# EAGLE design SparkFun_RS323_Shifter (EAGLE 7.2.0)
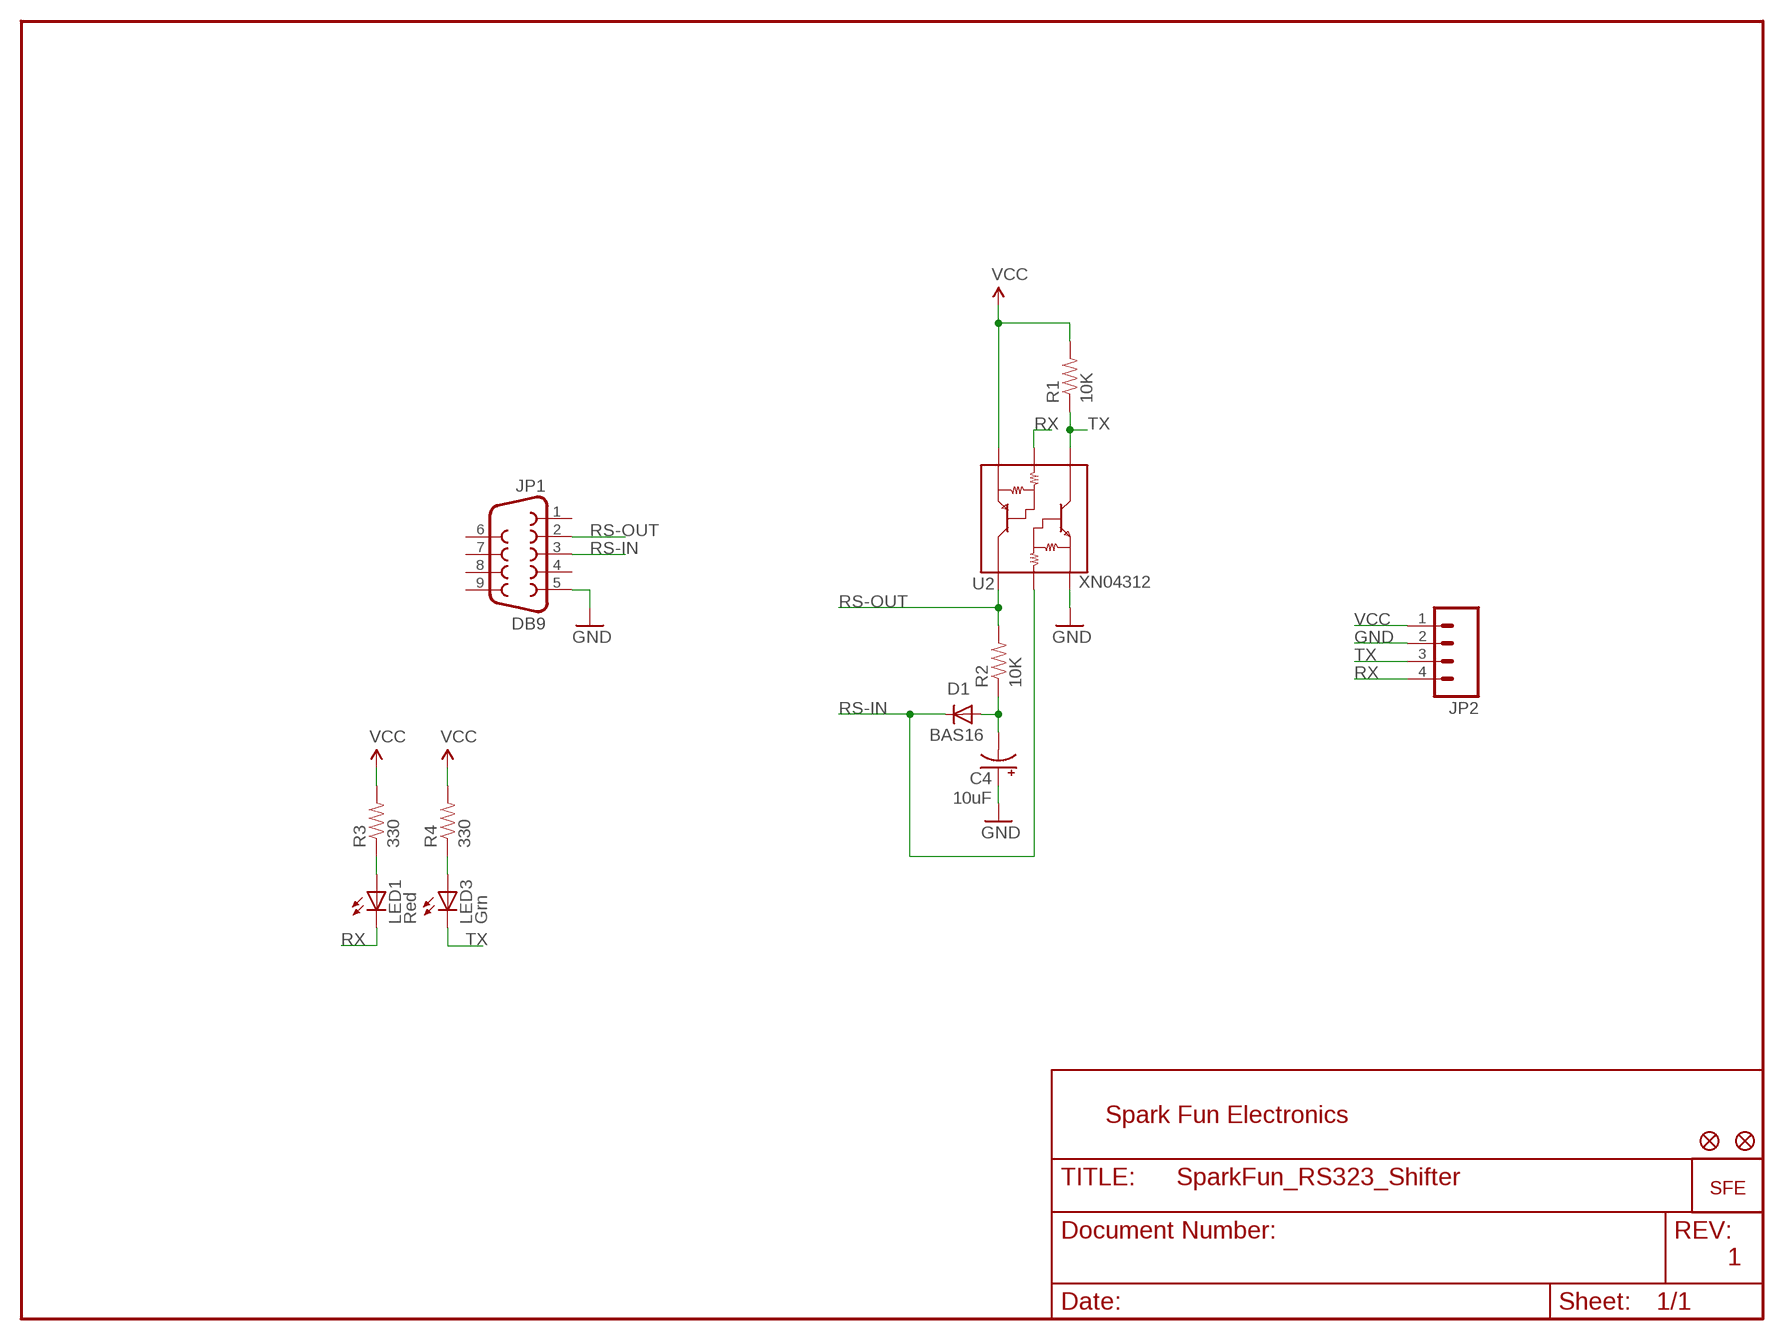
[diagram p0: schematic, sheet 1]

## Parts
C4  10uF  CAP_POL1206  [EIA3216]
D1  BAS16  DIODESOD  [SOD-323]
E$1  FIDUCIAL1X2  [FIDUCIAL-1X2]
E$2  FIDUCIAL1X2  [FIDUCIAL-1X2]
JP1  DB9  DB9FEMALE  [DB9]
JP2  M04PTH  [1X04]
LED1  Red  LED1206  [LED-1206]
LED3  Grn  LED1206  [LED-1206]
R1  10K  RESISTOR0603-RES  [0603-RES]
R2  10K  RESISTOR0603-RES  [0603-RES]
R3  330  RESISTOR0603-RES  [0603-RES]
R4  330  RESISTOR0603-RES  [0603-RES]
U2  XN04312  XN04312SOT  [SOT23-6]
U$1  LOGO-SFENEW  [SFE-NEW-WEBLOGO]

## Nets
GND: C4.A(+) JP1.5 JP2.2 U2.6(E1)
N$1: LED1.A R3.1
N$2: LED3.A R4.1
N$4: C4.C(-) D1.2(A) R2.1
RS-IN: D1.1(C) JP1.3 U2.5(B1)
RS-OUT: JP1.2 R2.2 U2.4(C2)
RX: JP2.4 LED1.C U2.2(B2)
TX: JP2.3 LED3.C R1.1 U2.1(C1)
VCC: JP2.1 R1.2 R3.2 R4.2 U2.3(E2)
Unconnected: JP1.1 JP1.4 JP1.6 JP1.7 JP1.8 JP1.9

## Notes on the sheet
- Spark Fun Electronics
- 1

## Library data of the parts
C4 = SparkFun:CAP_POL: Capacitor Polarized These are standard SMD and PTH capacitors. Normally 10uF, 47uF, and 100uF in electrolytic and tantalum varieties. Always verify the external diameter of the through hole cap, it varies with capacity, voltage, and manufacturer. The EIA devices should be standard.
D1 = SparkFun:DIODE: Diode These are standard reverse protection diodes and small signal diodes. SMA package can handle up to about 1A. SOD-323 can handle about 200mA. What the SOD-323 package when ordering, there are some mfgs out there that are 5-pin packages.
E$1 E$2 = SparkFun:FIDUCIAL: Fiducial Alignment Points Various fiducial points for machine vision alignment.
JP1 = SparkFun:DB9: DB9 Connector Standard DB9 (D-Sub 9) serial connector. Can be used for CAN bus as well as RS485 and RS232. Footprint production proven. Spark Fun Electronics SKU : PRT-00429
JP2 = SparkFun:M04: Header 4 Standard 4-pin 0.1" header. Use with straight break away headers (SKU : PRT-00116), right angle break away headers (PRT-00553), swiss pins (PRT-00743), machine pins (PRT-00117), and female headers (PRT-00115). Molex polarized connector foot print use with SKU : PRT-08231 with associated crimp pins and housings.
LED1 LED3 = SparkFun:LED: LEDs Standard schematic elements and footprints for 5mm, 3mm, 1206, and 0603 sized LEDs. 5mm - Spark Fun Electronics SKU : COM-00529 (and others)
R1-R4 = SparkFun:RESISTOR: Resistor Basic schematic elements and footprints for 0603, 1206, and PTH resistors.
U2 = SparkFun:XN04312: NPN/PNP Transistor Array Handy dandy transistor array for level shifting and inverting signals. Spark Fun Electronics SKU : COM-00588
U$1 = SparkFun:LOGO-SFE: Spark Fun Electronics PCB Logo This is the standard Spark Fun Electronics PCB logo.

## Net classes
0 default: width 0.203 mm
1 power: width 0.203 mm

## Board
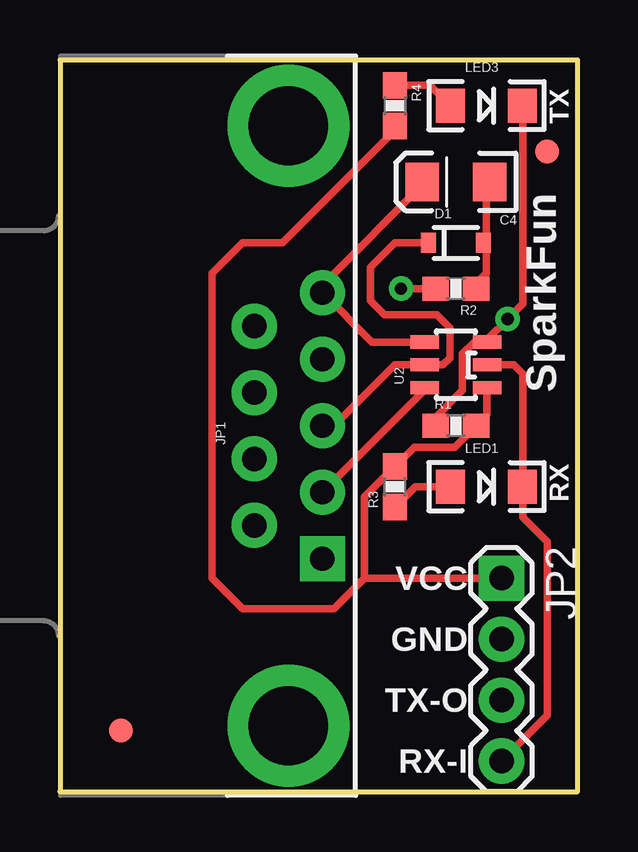
[diagram p1: board, top side]
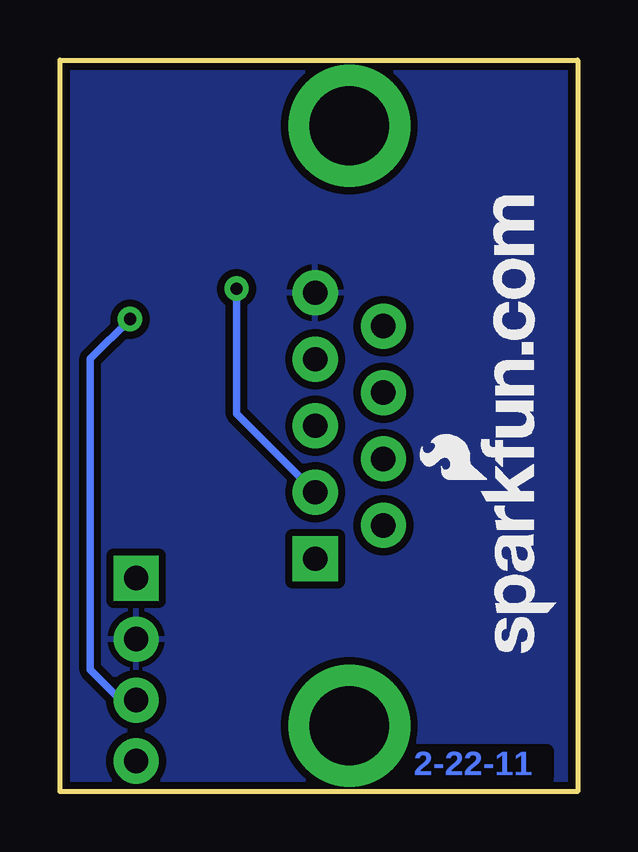
[diagram p2: board, bottom side, seen from below]

Size 21.59 x 30.48 mm. Coordinates in mm from the lower left corner, seen from the top.
Outline: 0,0 21.59,0 21.59,30.48 0,30.48 0,0
Copper layers (1*16): Top 0.035mm / dielectric 1.5mm / Bottom 0.035mm
Design rules "SparkFun": minimum track width 8mil, minimum drill 20mil, track to track 8mil, track to pad 8mil, pad to pad 8mil, via to via 8mil, smd to smd 8mil, copper to edge 10mil, drill to drill 8mil, minimum pad ring 12mil, minimum via ring 10mil, stop-mask expansion 4mil, vias tented up to drill 20mil, thermal gap 10mil

### Footprints (pad centres in the part's own frame; a part is rotated, then mirrored left to right if it is on the bottom)
EIA3216 = smd 1.4 x 1.6: A 1.4,0; C -1.4,0
SOD-323 = smd 0.63 x 0.83: 1 -1.15,0; 2 1.15,0
FIDUCIAL-1X2 = smd 1 x 1: 1 0,0
DB9 = drill 1.016 pad 1.88 square: 1 -5.54,-1.42 | drill 1.016 pad 1.88: 2 -2.77,-1.42; 3 0,-1.42; 4 2.77,-1.42; 5 5.54,-1.42; 6 -4.15,1.42; 7 -1.38,1.42; 8 1.38,1.42; 9 4.15,1.42 | drill 3.302 pad 5.08: G1 -12.5,0; G2 12.5,0
1X04 = drill 1.016 pad 1.88 square: 1 0,0 | drill 1.016 pad 1.88: 2 2.54,0; 3 5.08,0; 4 7.62,0
LED-1206 = smd 1.2 x 1.4: A -1.5,0; C 1.5,0
0603-RES = smd 1.1 x 1: 1 -0.85,0; 2 0.85,0
SOT23-6 = smd 0.55 x 1.2: 1 0.95,-1.3; 2 0,-1.3; 3 -0.95,-1.3; 4 -0.95,1.3; 5 0,1.3; 6 0.95,1.3

### Placement (x,y rotation side)
C4  16.51,25.4 180 top
D1  16.51,22.86 0 top
E$1  2.54,2.54 0 top
E$2  20.32,26.67 0 top
JP1  9.53,15.24 90 top
JP2  18.41,8.89 270 top
LED1  17.78,12.7 0 top
LED3  17.78,28.57 0 top
R1  16.51,15.24 0 top
R2  16.51,20.95 180 top
R3  13.97,12.7 90 top
R4  13.97,28.57 270 top
U2  16.51,17.78 90 top
U$1  0.9,5.79 90 bottom

### Tracks (layer width: path | path; a pad name or v marks a point on that pad's centre or on a via)
GND
  Top 0.305: C4.A 15.24,25.4 10.95,21.11 JP1.5 10.95,20.8 | 10.95,20.8 10.92,20.83 | U2.6 13.02,18.73 10.95,20.8
  Bottom 0.305: 10.79,20.95 10.84,20.91 JP1.5
  pour Bottom (isolate 0.305): 0,30.48 21.59,30.48 21.59,0 0,0
N$1
  Top 0.305: 16.51,12.7 LED1.A 14.82,12.7 R3.1
N$2
  Top 0.305: 16.26,28.57 LED3.A 15.43,29.43 R4.1
N$4
  Top 0.305: C4.C 17.78,25.4 17.78,22.98 D1.2 17.78,22.86 17.78,21.59 17.16,20.97 R2.1
RS-IN
  Top 0.305: JP1.3 11.43,15.24 13.97,17.78 U2.5 | U2.5 15.24,17.78 | U2.5 15.98,17.78 16.26,18.06 16.26,19.33 15.72,19.86 13.54,19.86 12.95,20.45 12.95,21.84 13.97,22.86 D1.1
RS-OUT  (via drill 0.51)
  Top 0.305: JP1.2 10.92,12.45 | JP1.2 | U2.4 15.21,16.73 JP1.2 | 15.86,20.84 R2.2 v14.22,20.95
  Bottom 0.305: 10.92,12.45 JP1.2 14.22,15.75 v14.22,20.95
RX
  Top 0.305: LED1.C 19.05,12.7 | JP2.4 20.32,3.17 20.32,10.41 19.3,11.43 19.3,12.7 LED1.C | U2.2 18.92,17.78 19.3,17.4 19.3,12.83 19.28,12.8 LED1.C
TX  (via drill 0.51)
  Top 0.305: LED3.C 19.28,28.47 19.3,28.45 19.3,20.32 v18.67,19.68 17.81,18.83 U2.1 17.85,18.73 | 17.85,18.73 17.86,18.72 | 17.85,18.73 17.83,18.75 17.3,18.75 16.79,18.24 16.79,16.71 15.66,15.58 R1.1
  Bottom 0.305: JP2.3 19.05,3.81 20.32,5.08 20.32,18.03 v18.67,19.68
VCC
  Top 0.305: 13.97,27.94 R4.2 13.97,27.56 9.27,22.86 7.62,22.86 6.35,21.59 6.35,8.89 7.62,7.62 11.43,7.62 12.7,8.89 | 12.7,8.89 JP2.1 | U2.3 17.81,15.69 R1.2 16.47,14.35 14.77,14.35 R3.2 12.7,12.28 12.7,8.89

### Text on the board
Bottom: 2-22-11
tPlace: TX | SparkFun | RX | VCC | GND | TX-O | RX-I